# EAGLE schematic ESP8266-07-RGB (EAGLE 6.2)
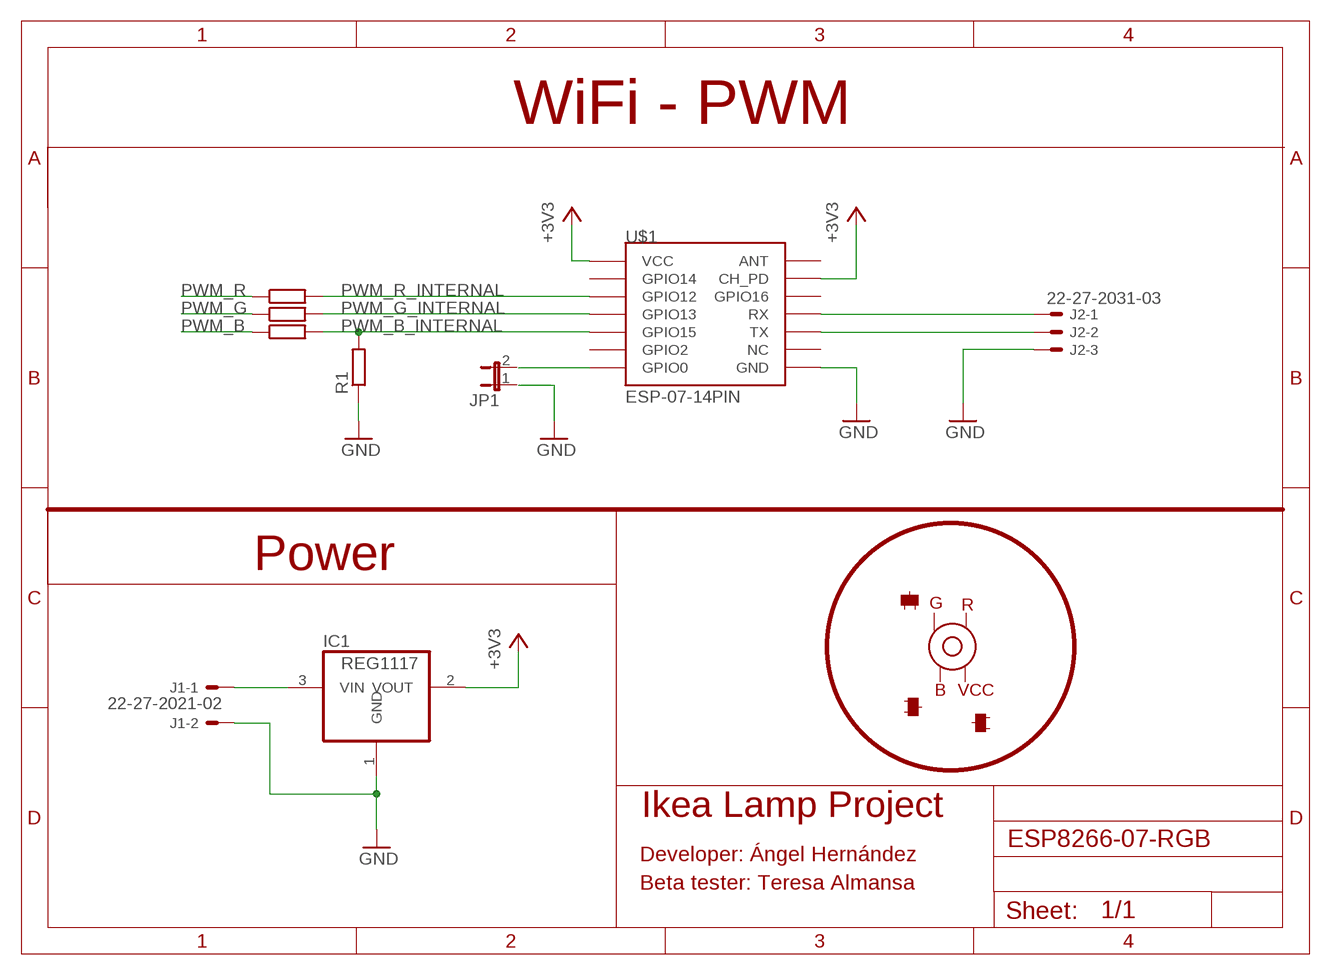
[diagram p0: schematic, sheet 1]

## Parts
IC1  REG1117  [SOT223]
J1  22-27-2021-02  [6410-02]
J2  22-27-2031-03  [6410-03]
JP1  JP1E  [JP1]
R1  R-EU_0204/7  [0204/7]
R2  R-EU_0204/7  [0204/7]
R3  R-EU_0204/7  [0204/7]
R4  R-EU_0204/7  [0204/7]
U$1  ESP-07-14PIN  [ESP-07-14PIN]

## Nets
+3V3: IC1.2(VOUT) U$1.CH_PD U$1.VCC
GND: IC1.1(GND) J1.2 J2.3 R1.1 U$1.GND
N$1: IC1.3(VIN) J1.1
N$2: U$1.GPIO0
N$3: J2.1 U$1.RX
N$4: J2.2 U$1.TX
PWM_B: R2.1
PWM_B_INTERNAL: R1.2 R2.2 U$1.GPIO15
PWM_G: R3.1
PWM_G_INTERNAL: R3.2 U$1.GPIO13
PWM_R: R4.1
PWM_R_INTERNAL: R4.2 U$1.GPIO12
Unconnected: JP1.1 JP1.2 U$1.ANT U$1.GPIO2 U$1.GPIO14 U$1.GPIO16 U$1.NC

## Notes on the sheet
- WiFi - PWM
- Power
- G | R
- B | VCC
- Ikea Lamp Project
- Developer: Ángel Hernández
- Beta tester: Teresa Almansa

## Library data of the parts
IC1 = burr-brown:REG1117: 800mA and 1A Low Dropout (LDO) Positive Regulator 1.8V, 2.5V, 2.85V, 3.3V, 5V, and Adj; MPN: REG1117; OC_FARNELL: 1097566; OC_NEWARK: 14P6981
J1 = con-molex:22-?-02: CONNECTOR wire to board 2.54 mm (.1 inch) pitch header; OC_FARNELL: unknown; OC_NEWARK: unknown
J2 = con-molex:22-?-03: CONNECTOR wire to board 2.54 mm (.1 inch) pitch header; OC_FARNELL: unknown; OC_NEWARK: unknown
JP1 = jumper:JP1E: JUMPER
R1-R4 = rcl:R-EU_: RESISTOR, European symbol
U$1 = esp8266modules:ESP-07-14PIN: ESP8266 Wifi Module ESP-07 - 14 pins; DIMENSIONS: 20.0 x 16.0 mm; PINS: 14; PITCH: 0.078" / 2 mm